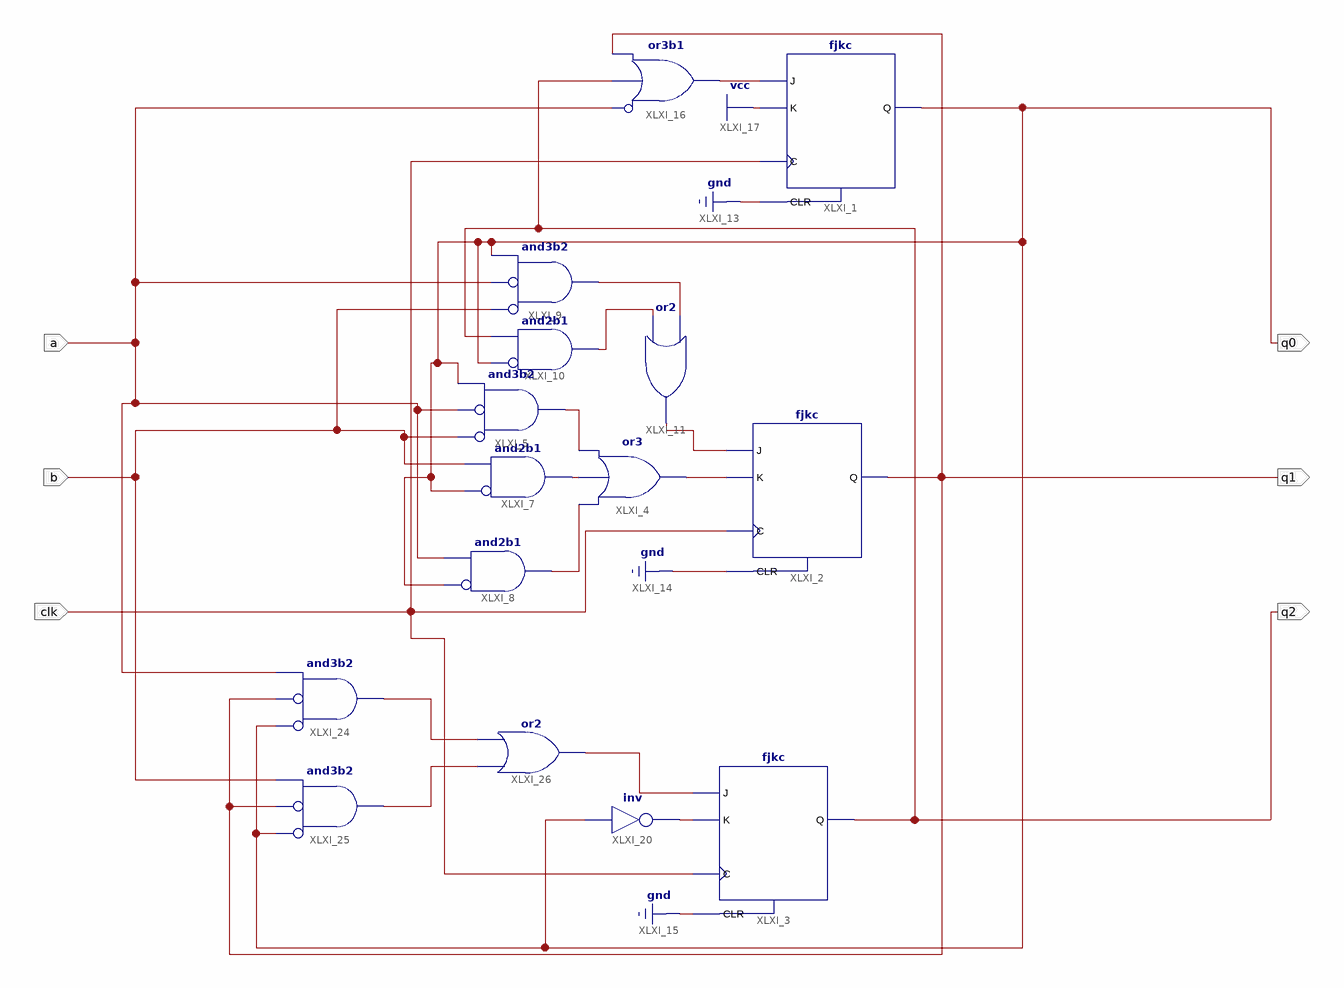
[diagram p0: schematic sheet 1]
// Xilinx ISE schematic counter_schem.sch (spartan6) as structural Verilog: 15 symbols, 6 ports
module counter_schem (
  input  clk,
  input  b,
  input  a,
  output q2,
  output q1,
  output q0
);

  wire XLXN_25, XLXN_26, XLXN_27, XLXN_28, XLXN_36, XLXN_37, XLXN_43, XLXN_53, XLXN_65, XLXN_81, XLXN_82,
       XLXN_83;

  fjkc XLXI_1 (.C(clk), .CLR(1'b0), .J(XLXN_53), .K(1'b1), .Q(q0));
  fjkc XLXI_2 (.C(clk), .CLR(1'b0), .J(XLXN_43), .K(XLXN_25), .Q(q1));
  fjkc XLXI_3 (.C(clk), .CLR(1'b0), .J(XLXN_81), .K(XLXN_65), .Q(q2));
  or XLXI_4 (XLXN_25, XLXN_28, XLXN_27, XLXN_26);
  and XLXI_5 (XLXN_26, ~b, ~a, q0);  // and3b2
  and XLXI_7 (XLXN_27, ~q0, b);  // and2b1
  and XLXI_8 (XLXN_28, ~q0, a);  // and2b1
  and XLXI_9 (XLXN_37, ~b, ~a, q0);  // and3b2
  and XLXI_10 (XLXN_36, ~q0, q2);  // and2b1
  or XLXI_11 (XLXN_43, XLXN_36, XLXN_37);
  or XLXI_16 (XLXN_53, ~a, q2, q1);  // or3b1
  not XLXI_20 (XLXN_65, q0);
  and XLXI_24 (XLXN_82, ~q0, ~q1, a);  // and3b2
  and XLXI_25 (XLXN_83, ~q0, ~q1, b);  // and3b2
  or XLXI_26 (XLXN_81, XLXN_83, XLXN_82);
endmodule
